# Altium schematic sheet BrauV2_1Wire.SchDoc
size 420 x 297 mm; PageSetup: Record=PageOptions|CenterHorizontal=True|CenterVertical=True|PrintScale=1.01|XCorrection=1.00|YCorrection=1.00|PrintKind=1|BorderSize=5000000|LeftOffset=0|BottomOffset=0|Orientation=2|PaperLength=1000|PaperWidth=1000|Scale=100|PaperSource=7|PrintQuality=-4|MediaType=1|DitherType=10|PaperKind=A3|PrintScaleMode=1; DocumentNumber: 8; SheetNumber: 8; SheetTotal: 22
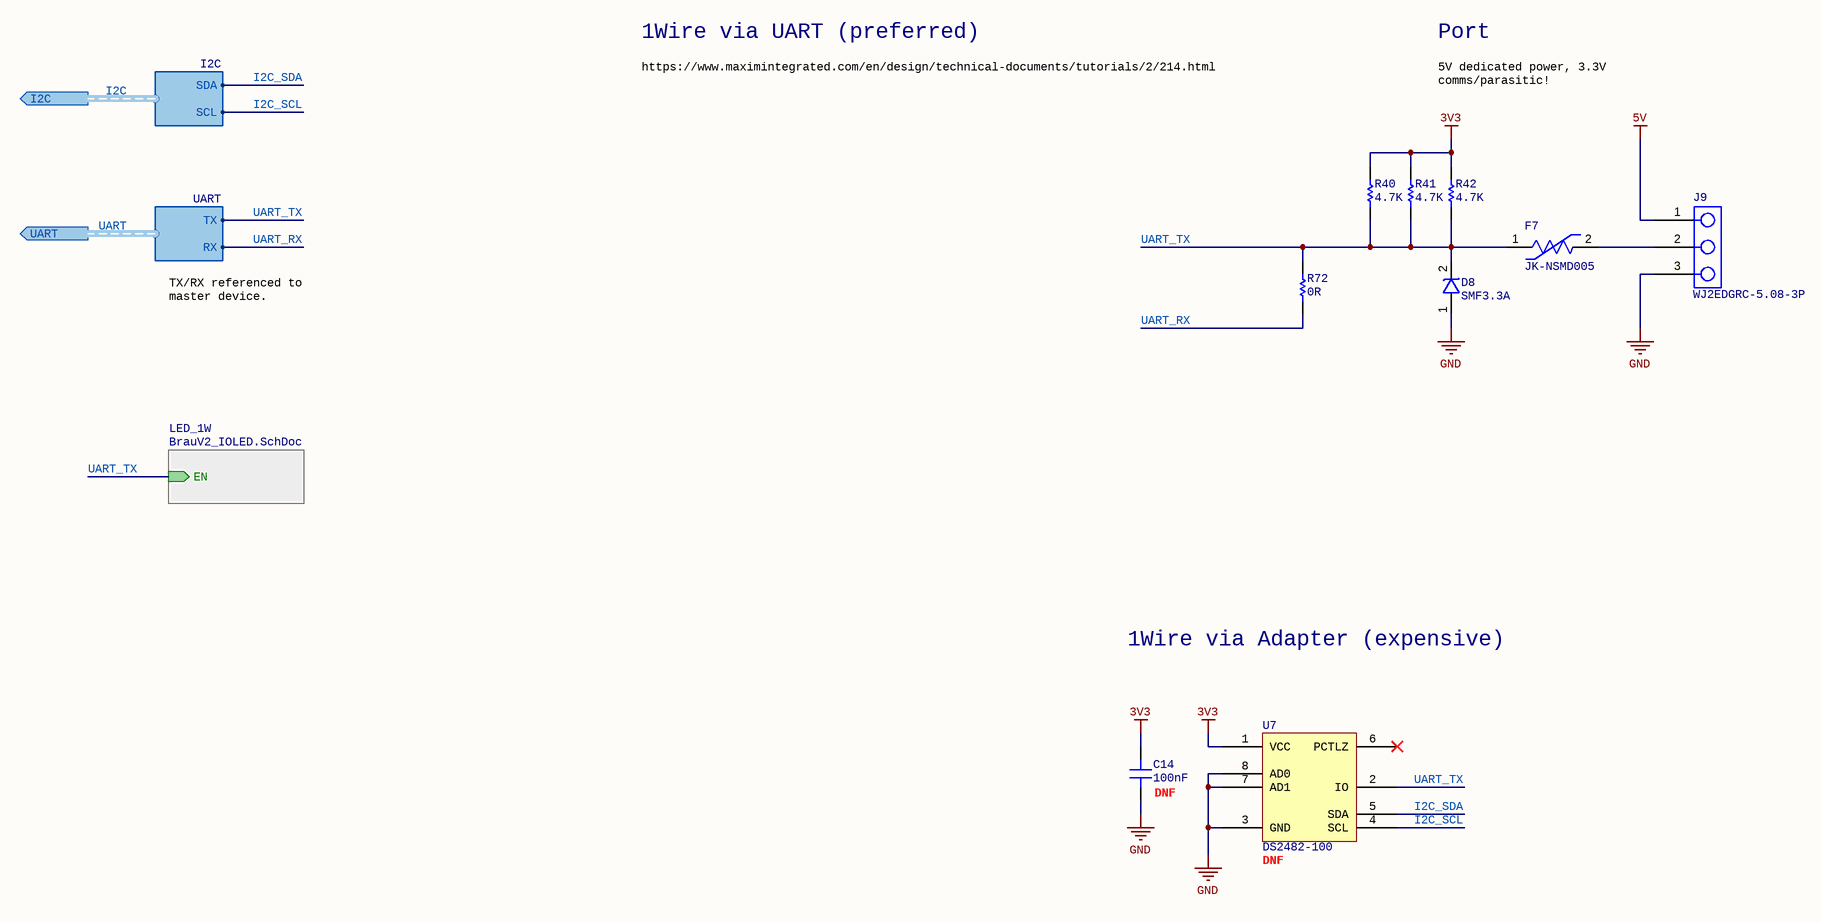
[diagram p0: BrauV2_1Wire.SchDoc]

## Parts
C14  Capacitance: 100nF  [SMD_CAP_0402(1005)_N]  (hidden comment: CC0402KRX5R6BB104)
D8  SMF3.3A  [SOD-123FL]
F7  JK-NSMD005  [SMD_RES_1206(3216)_N]
J9  WJ2EDGRC-5.08-3P  [796638-3]
R40  Resistance: 4.7K  [SMD_RES_0402(1005)_N]  (hidden comment: RC0402FR-074K7L)
R41  Resistance: 4.7K  [SMD_RES_0402(1005)_N]  (hidden comment: RC0402FR-074K7L)
R42  Resistance: 4.7K  [SMD_RES_0402(1005)_N]  (hidden comment: RC0402FR-074K7L)
R72  Resistance: 0R  [SMD_RES_0402(1005)_N]  (hidden comment: RC0402FR-070RL)
U7  DS2482-100  [SOIC-8-3.9mm]

## Sub-sheets
LED_1W = BrauV2_IOLED.SchDoc: EN (in)

## Ports
I2C (out, harness I2C), UART (out, harness UART)

## Harnesses
I2C: SDA, SCL
UART: TX, RX

## Nets
3V3: C14.2 R40.2 R41.2 R42.2 U7.1(VCC)
5V: J9.1
GND: C14.1 D8.1(ANODE) J9.3 U7.3(GND) U7.7(AD1) U7.8(AD0)
I2C_SCL: U7.4(SCL) ; port I2C.SCL  [project net I2C.SCL]
I2C_SDA: U7.5(SDA) ; port I2C.SDA  [project net I2C.SDA]
UART_RX: R72.1 ; port UART.RX  [project net UART.RX]
UART_TX: D8.2(CATHODE) F7.1 R40.1 R41.1 R42.1 R72.2 U7.2(IO) ; sheet LED_1W/EN, port UART.TX  [project net UART.TX]
NetF7_2: F7.2 J9.2

Not connected (* = marked no-connect by the designer): U7 6(PCTLZ)*

## Buses and harness runs
harness I2C = port I2C
harness UART = port UART

## Notes on the sheet
- 1Wire via UART (preferred)
- Port
- https://www.maximintegrated.com/en/design/technical-documents/tutorials/2/214.html
- 5V dedicated power, 3.3V comms/parasitic!
- TX/RX referenced to master device.
- 1Wire via Adapter (expensive)
- (near C14) DNF
- (near U7) DNF
- FILE NAME
- PROJECT
- TITLE
- REV
- AUTHOR
- SIZE
- SHEET
- DATE
- OF
- A3

## Library data of the parts
C14 = 100nF 0402 10V 10%: 100nF ±10% 10V X5R 0402 Multilayer Ceramic Capacitors MLCC - SMD/SMT RoHS; Package: 0402; Tolerance: 10%; Voltage Rating: 10V
D8 = SMF3.3A: Unidirectional 3.3V 5.2V 8V 25A SOD-123 TVS RoHS
F7 = JK-NSMD005: 60V 150mA 1.5s 1206 PTC Resettable Fuses RoHS
J9 = WJ2EDGRC-5.08-3P: Covered（4Sided） 3 1 0.200"（5.08mm） 3 P=5.08mm Pluggable System Terminal Block RoHS
R40-R42 = 4K7 0402 1% 1/16W: 4.7kΩ ±1% 1/16W ±100ppm/℃ 0402 Chip Resistor - Surface Mount RoHS; Package: 0402; Tolerance: 1%; Power Rating: 1/16W
R72 = 0R 0402 1% 1/16W: 0Ω ±1% 1/16W 0402 Chip Resistor - Surface Mount RoHS; Package: 0402; Tolerance: 1%; Power Rating: 1/16W
U7 = DS2482-100: Single-Channel 1-Wire Master